# Altium schematic sheet Battery Charger.SchDoc: Battery Charger
size A4; SheetNumber: 5; SheetTotal: 37
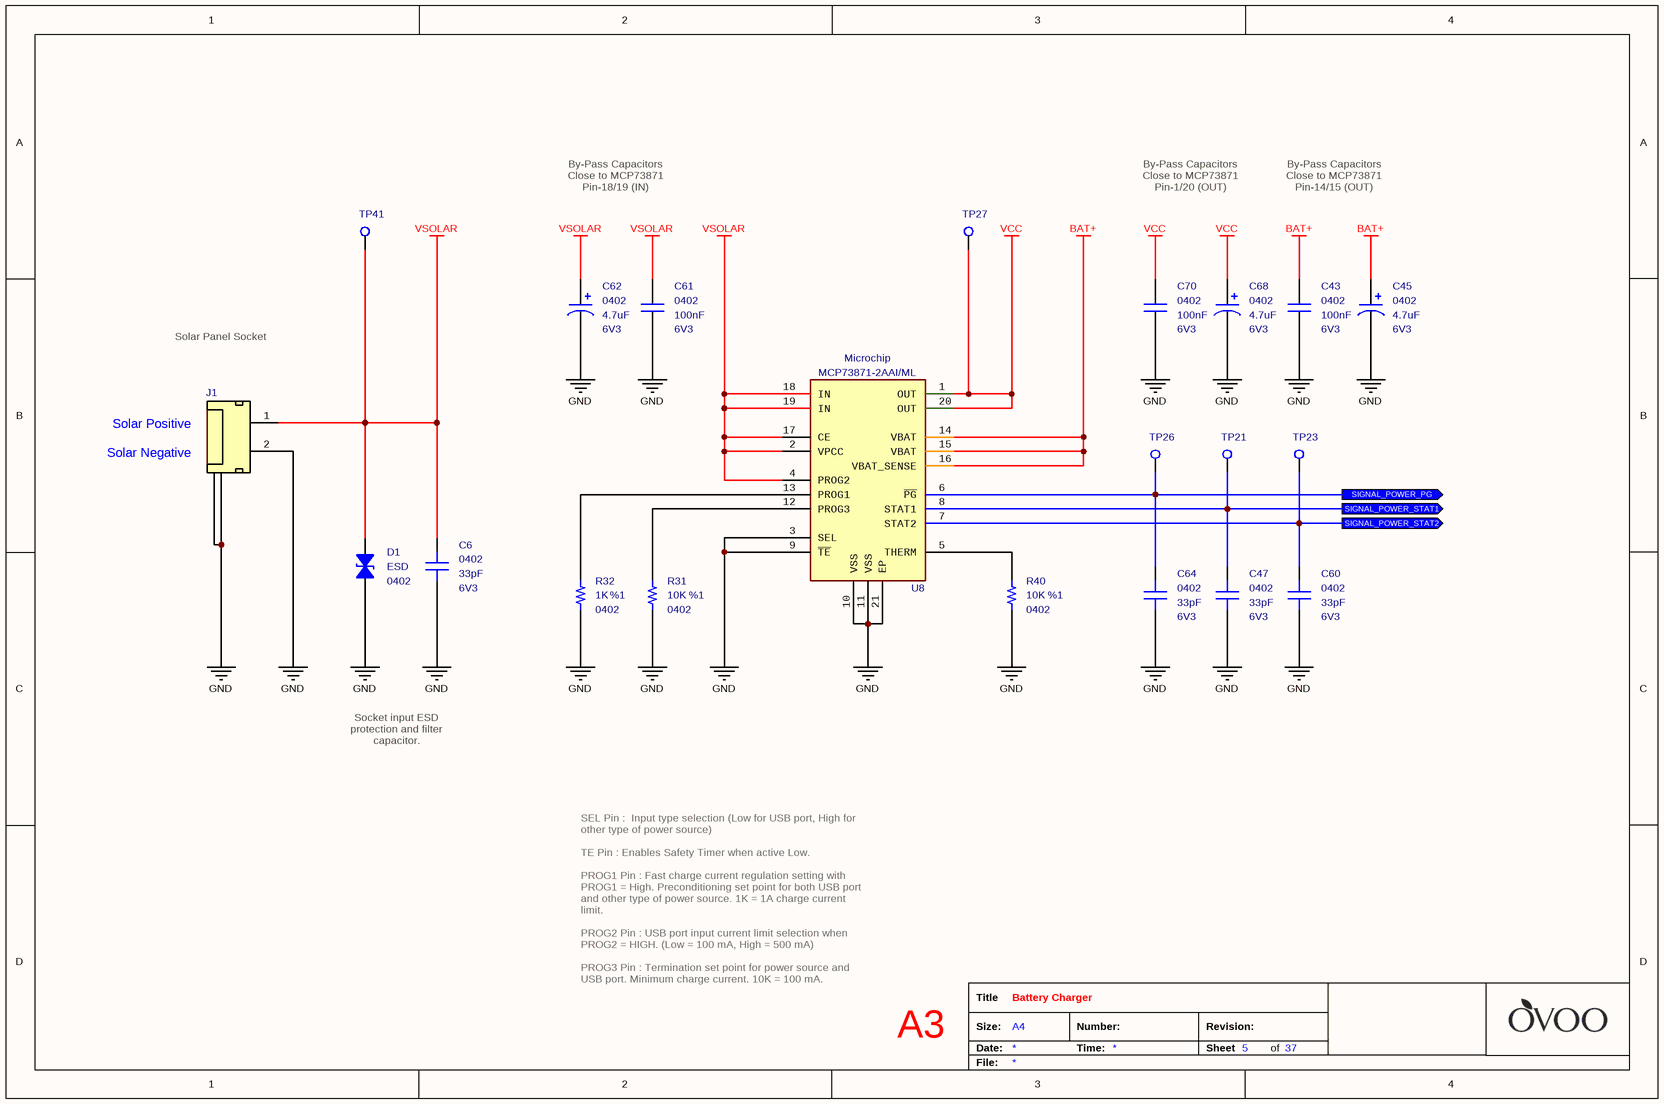
[diagram p0: Battery Charger.SchDoc]

## Parts
C6  value 33pF  Case: 0402  Voltage: 6V3  [CAPACITOR_0402]  (hidden comment: Multilayer Ceramic Capacitor)
C43  value 100nF  Case: 0402  Voltage: 6V3  [CAPACITOR_0402]  (hidden comment: Multilayer Ceramic Capacitor)
C45  value 4.7uF  Case: 0402  Voltage: 6V3  [CAPACITOR_0402]  (hidden comment: Multilayer Ceramic Capacitors)
C47  value 33pF  Case: 0402  Voltage: 6V3  [CAPACITOR_0402]  (hidden comment: Multilayer Ceramic Capacitor)
C60  value 33pF  Case: 0402  Voltage: 6V3  [CAPACITOR_0402]  (hidden comment: Multilayer Ceramic Capacitor)
C61  value 100nF  Case: 0402  Voltage: 6V3  [CAPACITOR_0402]  (hidden comment: Multilayer Ceramic Capacitor)
C62  value 4.7uF  Case: 0402  Voltage: 6V3  [CAPACITOR_0402]  (hidden comment: Multilayer Ceramic Capacitors)
C64  value 33pF  Case: 0402  Voltage: 6V3  [CAPACITOR_0402]  (hidden comment: Multilayer Ceramic Capacitor)
C68  value 4.7uF  Case: 0402  Voltage: 6V3  [CAPACITOR_0402]  (hidden comment: Multilayer Ceramic Capacitors)
C70  value 100nF  Case: 0402  Voltage: 6V3  [CAPACITOR_0402]  (hidden comment: Multilayer Ceramic Capacitor)
D1  Case: 0402  [ESD_0402]  (hidden comment: ESD Suppressors)
J1  Solar Power Socket  [Connector_Tunic 2P - H]  (value not drawn)
R31  value 10K  Tolerance: %1  Case: 0402  [RESISTOR_0402]  (hidden comment: Thick Film Resistor)
R32  value 1K  Case: 0402  Tolerance: %1  [RESISTOR_0402]  (hidden comment: Thick Film Resistor)
R40  value 10K  Tolerance: %1  Case: 0402  [RESISTOR_0402]  (hidden comment: Thick Film Resistor)
TP21  PCB - Test Point  [Test_Pad - Hole]  (value not drawn)  (no BOM)
TP23  PCB - Test Point  [Test_Pad - Hole]  (value not drawn)  (no BOM)
TP26  PCB - Test Point  [Test_Pad - Hole]  (value not drawn)  (no BOM)
TP27  PCB - Test Point  [Test_Pad - Hole]  (value not drawn)  (no BOM)
TP41  PCB - Test Point  [Test_Pad - Hole]  (value not drawn)  (no BOM)
U8  Manufacturer_Name: Microchip  Manufacturer_Part_Number: MCP73871-2AAI/ML  [QFN20]  (hidden comment: Battery Charger)

## Ports
SIGNAL_POWER_PG (out), SIGNAL_POWER_STAT1 (out), SIGNAL_POWER_STAT2 (out)

## Nets
BAT+: C43.1 C45.1 U8.14(VBAT) U8.15(VBAT) U8.16(VBAT_SENSE)
GND: C6.1 C43.2 C45.2 C47.2 C60.2 C61.2 C62.2 C64.2 C68.2 C70.2 D1.1 J1.2(GND) J1.3(Termination) J1.4(Termination) R31.1 R32.1 R40.1 U8.3(SEL) U8.9(~{TE}) U8.10(VSS) U8.11(VSS) U8.21(EP)
VCC: C68.1 C70.1 TP27.1 U8.1(OUT) U8.20(OUT)
VSOLAR: C6.2 C61.1 C62.1 D1.2 J1.1(VSolar) TP41.1 U8.2(VPCC) U8.4(PROG2) U8.17(CE) U8.18(IN) U8.19(IN)
SIGNAL_POWER_PG: C64.1 TP26.1 U8.6(~{PG}) ; port SIGNAL_POWER_PG
SIGNAL_POWER_STAT1: C47.1 TP21.1 U8.8(STAT1) ; port SIGNAL_POWER_STAT1
SIGNAL_POWER_STAT2: C60.1 TP23.1 U8.7(STAT2) ; port SIGNAL_POWER_STAT2
NetR31_2: R31.2 U8.12(PROG3)
NetR32_2: R32.2 U8.13(PROG1)
NetR40_2: R40.2 U8.5(THERM)

## Notes on the sheet
- By-Pass Capacitors
  Close to MCP73871
  Pin-18/19 (IN)
- By-Pass Capacitors
  Close to MCP73871
  Pin-1/20 (OUT)
- By-Pass Capacitors
  Close to MCP73871
  Pin-14/15 (OUT)
- Solar Panel Socket
- (near J1) Solar Positive
  Solar Negative
- Socket input ESD protection and filter capacitor.
- SEL Pin :  Input type selection (Low for USB port, High for other type of power source)
  TE Pin : Enables Safety Timer when active Low.
  PROG1 Pin : Fast charge current regulation setting with PROG1 = High. Preconditioning set point for both USB port and other type of power source. 1K = 1A charge current limit.
  PROG2 Pin : USB port input current limit selection when PROG2 = HIGH. (Low = 100 mA, High = 500 mA)
  PROG3 Pin : Termination set point for power source and USB port. Minimum charge current. 10K = 100 mA.
- A3
- Title
- Size:
- Date:
- A4
- Number:
- Time:
- Revision:
- Sheet
- of
- File:
- (in symbol Diode - ESD Protection) ESD

## Library data of the parts
C6 C47 C60 C64 = Capacitor - 33pF [0402-6V3]: Capacitor - 33pF [0402] (Ceramic); Manufacturer_Name: Kemet; Manufacturer_Part_Number: C0402C330J9RACAUTO; Dielectric: X7R; Tolerance: 10%; Height: 0.5mm; Mouser_Part_Number: 80-C0402C330J9RAUTO; Maximum Operating Temperature: +125; Minimum Operating Temperature: -55; ROHS: Yes; ComponentLink1Description: DataSheet; ComponentLink1URL: https://api.kemet.com/component-edge/download/datasheet/C0402C330J9RACAUTO.pdf; ComponentLink2Description: Mouser; ComponentLink2URL: https://www.mouser.com/Search/Refine.aspx?Keyword=80-C0402C330J9RAUTO; Supplier 1: Mouser; Supplier Part Number 1: 80-C0402C330J9RAUTO
C43 C61 C70 = Capacitor - 100nF [0402-6V3]: Capacitor - 100nF [0402-6V3] (Ceramic); Manufacturer_Name: AVX; Manufacturer_Part_Number: 04026D104KAT4A; Dielectric: X5R; Tolerance: %10; Height: 0.25mm; Mouser_Part_Number: 581-04026D104KAT4A; ComponentLink1Description: Mouser; ComponentLink1URL: https://www.mouser.com.tr/ProductDetail/AVX/04026D104KAT4A?qs=sGAEpiMZZMs0AnBnWHyRQPg4iYkCw7IMED%2F4kpqgf7w%3D; ComponentLink2Description: DataSheet; ComponentLink2URL: https://www.mouser.com.tr/datasheet/2/40/cx5r-776519.pdf; ROHS: Yes; Maximum Operating Temperature: +85; Minimum Operating Temperature: -55; Supplier 1: Avnet; Supplier Part Number 1: 04026D104KAT4A
C45 C62 C68 = Capacitor - 4.7uF [0402-6V3): Capacitor - 4.7uF [0402] (Ceramic); Manufacturer_Name: Kemet; Manufacturer_Part_Number: C0402C475M9PACTU; Dielectric: X5R; Tolerance: %20; Height: 0.5mm; Mouser_Part_Number: 80-C0402C475M9P; ComponentLink1Description: Mouser; ComponentLink1URL: https://www.mouser.com.tr/ProductDetail/KEMET/C0402C475M9PACTU?qs=x4XeXhDQKnr0GX0Xu9DUoQ==; ComponentLink2Description: DataSheet; ComponentLink2URL: https://www.mouser.com.tr/datasheet/2/40/cx5r-776519.pdf; ROHS: Yes; Maximum Operating Temperature: +85; Minimum Operating Temperature: -55; Supplier 1: Mouser; Supplier 2: Arrow; Supplier 3: Farnell; Supplier 4: Digi-Key; Supplier Part Number 1: 80-C0402C475M9P; Supplier Part Number 2: C0402C475M9PACTU; Supplier Part Number 3: 2750760; Supplier Part Number 4: 399-13068-1-ND
D1 = Diode - ESD Protection: TVS Diode (Bi-directional); Manufacturer_Name: Bussmann / Eaton; Manufacturer_Part_Number: 0402ESDA-MLP1; Clamping Voltage: 35V; Diode Capacitance: 0.05pF; Polarity: Bidirectional; Voltage ESD Air Gap: 15kV; Voltage ESD Contact: 8kV; Working Voltage: 30V; Height: 0.436mm; Mouser_Part_Number: 504-0402ESDA-MLP1; Maximum Operating Temperature: +125; Minimum Operating Temperature: -55; ROHS: Yes; ComponentLink1Description: DataSheet; ComponentLink1URL: https://www.mouser.com.tr/datasheet/2/87/47c59e11-d058-4882-bc35-d8572f2ca054-38826.pdf; ComponentLink2Description: Mouser; ComponentLink2URL: https://www.mouser.com.tr/ProductDetail/Bussmann-Eaton/0402ESDA-MLP1?qs=%2Fha2pyFadughxyc7TyLWeW%2FUvipVY6Ex3naV%2FjpO3plZBZWDLqV4bw%3D%3D; Supplier 1: Mouser; Supplier 2: Digi-Key; Supplier Part Number 2: 283-2964-1-ND; Supplier Part Number 1: 504-0402ESDA-MLP1
J1 = Connector - Mini Tunic 2P (1.25): Mini Tunic Connector with 2P; Manufacturer_Name: Molex; Manufacturer_Part_Number: 53261-0271; Height: 3.55mm; Mouser_Part_Number: 538-53261-0271; ROHS: Yes; Supplier 1: Mouser; Supplier 2: Digi-Key; Supplier Part Number 1: 538-53261-0271; Supplier Part Number 2: WM7620DKR-ND
R31 R40 = Resistor - 10K: Thick Film Resistors - SMD 1/16 W 10 Kohms 1%; Manufacturer_Name: Vishay; Manufacturer_Part_Number: CRCW040210K0FKED; Height: 0.4mm; Mouser_Part_Number: 71-CRCW0402-10K-E3; ComponentLink1Description: DataSheet; ComponentLink1URL: https://www.mouser.com.tr/datasheet/2/427/dcrcwe3-1762152.pdf; ComponentLink2Description: Mouser; ComponentLink2URL: https://www.mouser.com.tr/ProductDetail/Vishay-Dale/CRCW040210K0FKED?qs=sGAEpiMZZMu61qfTUdNhG2DpbjADlD3GcalbOv9utCY%3D; Supplier 1: Mouser; Supplier 2: Digi-Key; Supplier Part Number 1: 71-CRCW040210K0FKEDH; Supplier Part Number 2: 541-10.0KYCT-ND
R32 = Resistor - 1K: Thick Film Resistors - SMD 1/16 W 1.0 Kohms 1%; Manufacturer_Name: Vishay; Manufacturer_Part_Number: CRCW04021K00FKED; Height: 0.35mm; Mouser_Part_Number: 71-CRCW0402-1.0K-E3; ComponentLink1Description: DataSheet; ComponentLink1URL: https://www.mouser.com.tr/datasheet/2/427/dcrcwe3-1762152.pdf; ComponentLink2Description: Mouser; ComponentLink2URL: https://www.mouser.com.tr/ProductDetail/Vishay-Dale/CRCW04021K00FKED?qs=sGAEpiMZZMu61qfTUdNhG2DpbjADlD3GFJ4zSbeLqG8%3D; Supplier 1: Mouser; Supplier 2: Digi-Key; Supplier Part Number 1: 71-CRCW0402-1.0K-E3; Supplier Part Number 2: 541-1.00KLCT-ND
TP21 TP23 TP26 TP27 TP41 = PCB - Test Point: Test Point
U8 = IC - MCP73871: Battery Management USB/AC Battery Charger; Height: 1mm; Mouser_Part_Number: 579-MCP73871-2AAI/ML; ComponentLink1Description: DataSheet; ComponentLink1URL: https://www.mouser.com.tr/datasheet/2/268/22090a-52174.pdf; ComponentLink2Description: Mouser; ComponentLink2URL: https://www.mouser.com.tr/ProductDetail/Microchip-Technology/MCP73871-2AAI-ML?qs=sGAEpiMZZMurkbBc78uWVAic%2FwpkFaWG; Supplier 1: Mouser; Supplier 2: Future Electronics; Supplier 3: Farnell; Supplier 4: Digi-Key; Supplier 5: Newark; Supplier Part Number 1: 579-MCP73871-2AAI/ML; Supplier Part Number 2: MCP73871-2AAI/ML-TUBE; Supplier Part Number 3: 1642487; Supplier Part Number 4: MCP73871-2AAI/ML-ND; Supplier Part Number 5: 09P4000; Case: QFN-20